# Altium schematic sheet ORD_CH341A.SchDoc
size 420 x 297 mm; Address1: Address1; Address2: Address2; Address3: Address3; Address4: Address4; DocumentNumber: АБВГ.123456.001 Э3; SheetNumber: 1; Scale: 1:1; DocumentType: Схема электрическая принципиальная; FirstReferrence: АБВГ.123456.001
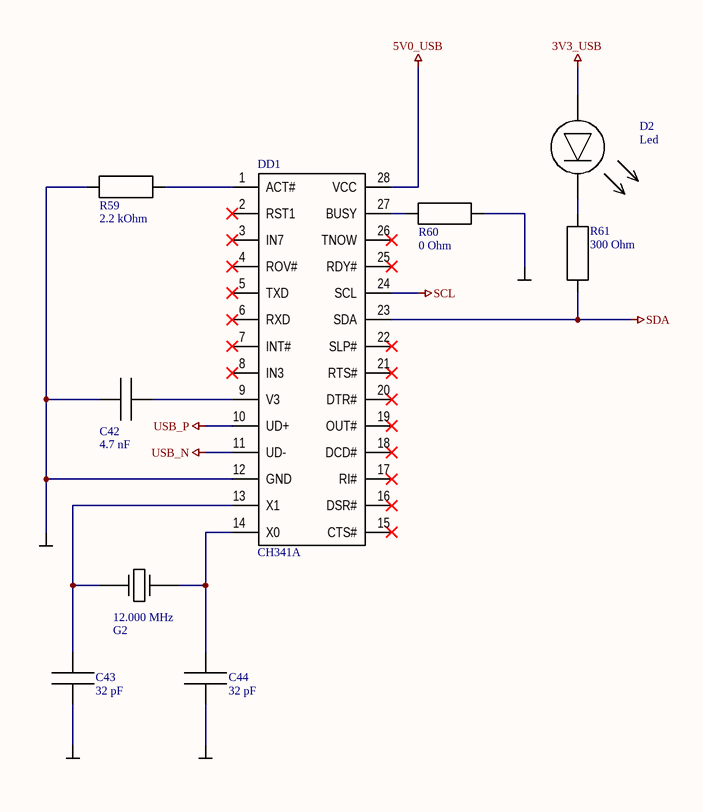
[diagram p0: ORD_CH341A.SchDoc]

## Parts
C42  4.7 nF  [C0603[1608]]
C43  32 pF  [C0603[1608]]
C44  32 pF  [C0603[1608]]
D2  Led  [LED]
DD1  CH341A  [SOIC28]
G2  12.000 MHz  [HC-49]
R59  2.2 kOhm  [R0805[2012]]
R60  0 Ohm  [R0603[1608]]
R61  300 Ohm  [R0603[1608]]

## Nets
3V3_USB: D2.1
5V0_USB: DD1.28(VCC)
GND: C42.1 C43.1 C44.1 DD1.12(GND) R59.1 R60.2
SCL: DD1.24(SCL)
SDA: DD1.23(SDA) R61.1
USB_N: DD1.11(UD-)
USB_P: DD1.10(UD+)
NetC42_2: C42.2 DD1.9(V3)
NetC43_2: C43.2 DD1.13(X1) G2.1
NetC44_2: C44.2 DD1.14(X0) G2.2
NetD2_2: D2.2 R61.2
NetDD1_1: DD1.1(ACT#) R59.2
NetDD1_27: DD1.27(BUSY) R60.1

Not connected (* = marked no-connect by the designer): DD1 2(RST1)* 3(IN7)* 4(ROV#)* 5(TXD)* 6(RXD)* 7(INT#)* 8(IN3)* 15(CTS#)* 16(DSR#)* 17(RI#)* 18(DCD#)* 19(OUT#)* 20(DTR#)* 21(RTS#)* 22(SLP#)* 25(RDY#)* 26(TNOW)*

## Notes on the sheet
- Перв. примен.
- Справ. №
- Подп. и дата
- Инв. № дубл.
- Взам. инв. №
- Разраб.
- Изм.
- Лист
- № докум.
- Подп.
- Дата
- Лит.
- Масса
- Масштаб
- Пров.
- Т.контр.
- Листов
- Инв. № подл.
- Утв.
- Н.контр.
- 2.106-A3
- Копировал
- Формат А3

## Library data of the parts
C42-C44 = Capacitor: Manufacture: *; ManufacturerPartNumber: *; Power/Voltage: *; Quantity: *; Rem: *; TKE: *; Tolerance: *; Корпус: *; Примечание: *
  C42: Value: 4.7 nF
  C43 C44: Value: 32 pF
DD1 = CH341A: USB Bus Convert Chip CH341A; Manufacturer_Name: Spin Semiconductor; Manufacturer_Part_Number: FV-1 Reverb IC; Geometry.Height: 2.51mm; Mouser Part Number: *; Mouser Price/Stock: *; RS Part Number: *; RS Price/Stock: *; Datasheet Link: http://www.spinsemi.com/Products/datasheets/spn1001/FV-1.pdf
G2 = Crystal_2pin: Value: *
R59-R61 = Resistor: Manufacture: *; ManufacturerPartNumber: *; Power/Voltage: *; Quantity: *; Rem: *; TKE: *; Tolerance: *; Корпус: *; Примечание: *
  R59: Value: 2.2 kOhm
  R60: Value: 0 Ohm
  R61: Value: 300 Ohm
D2 = Led: ManufacturerPartNumber: *